# EAGLE design Stepper Board (EAGLE 7.5.0)
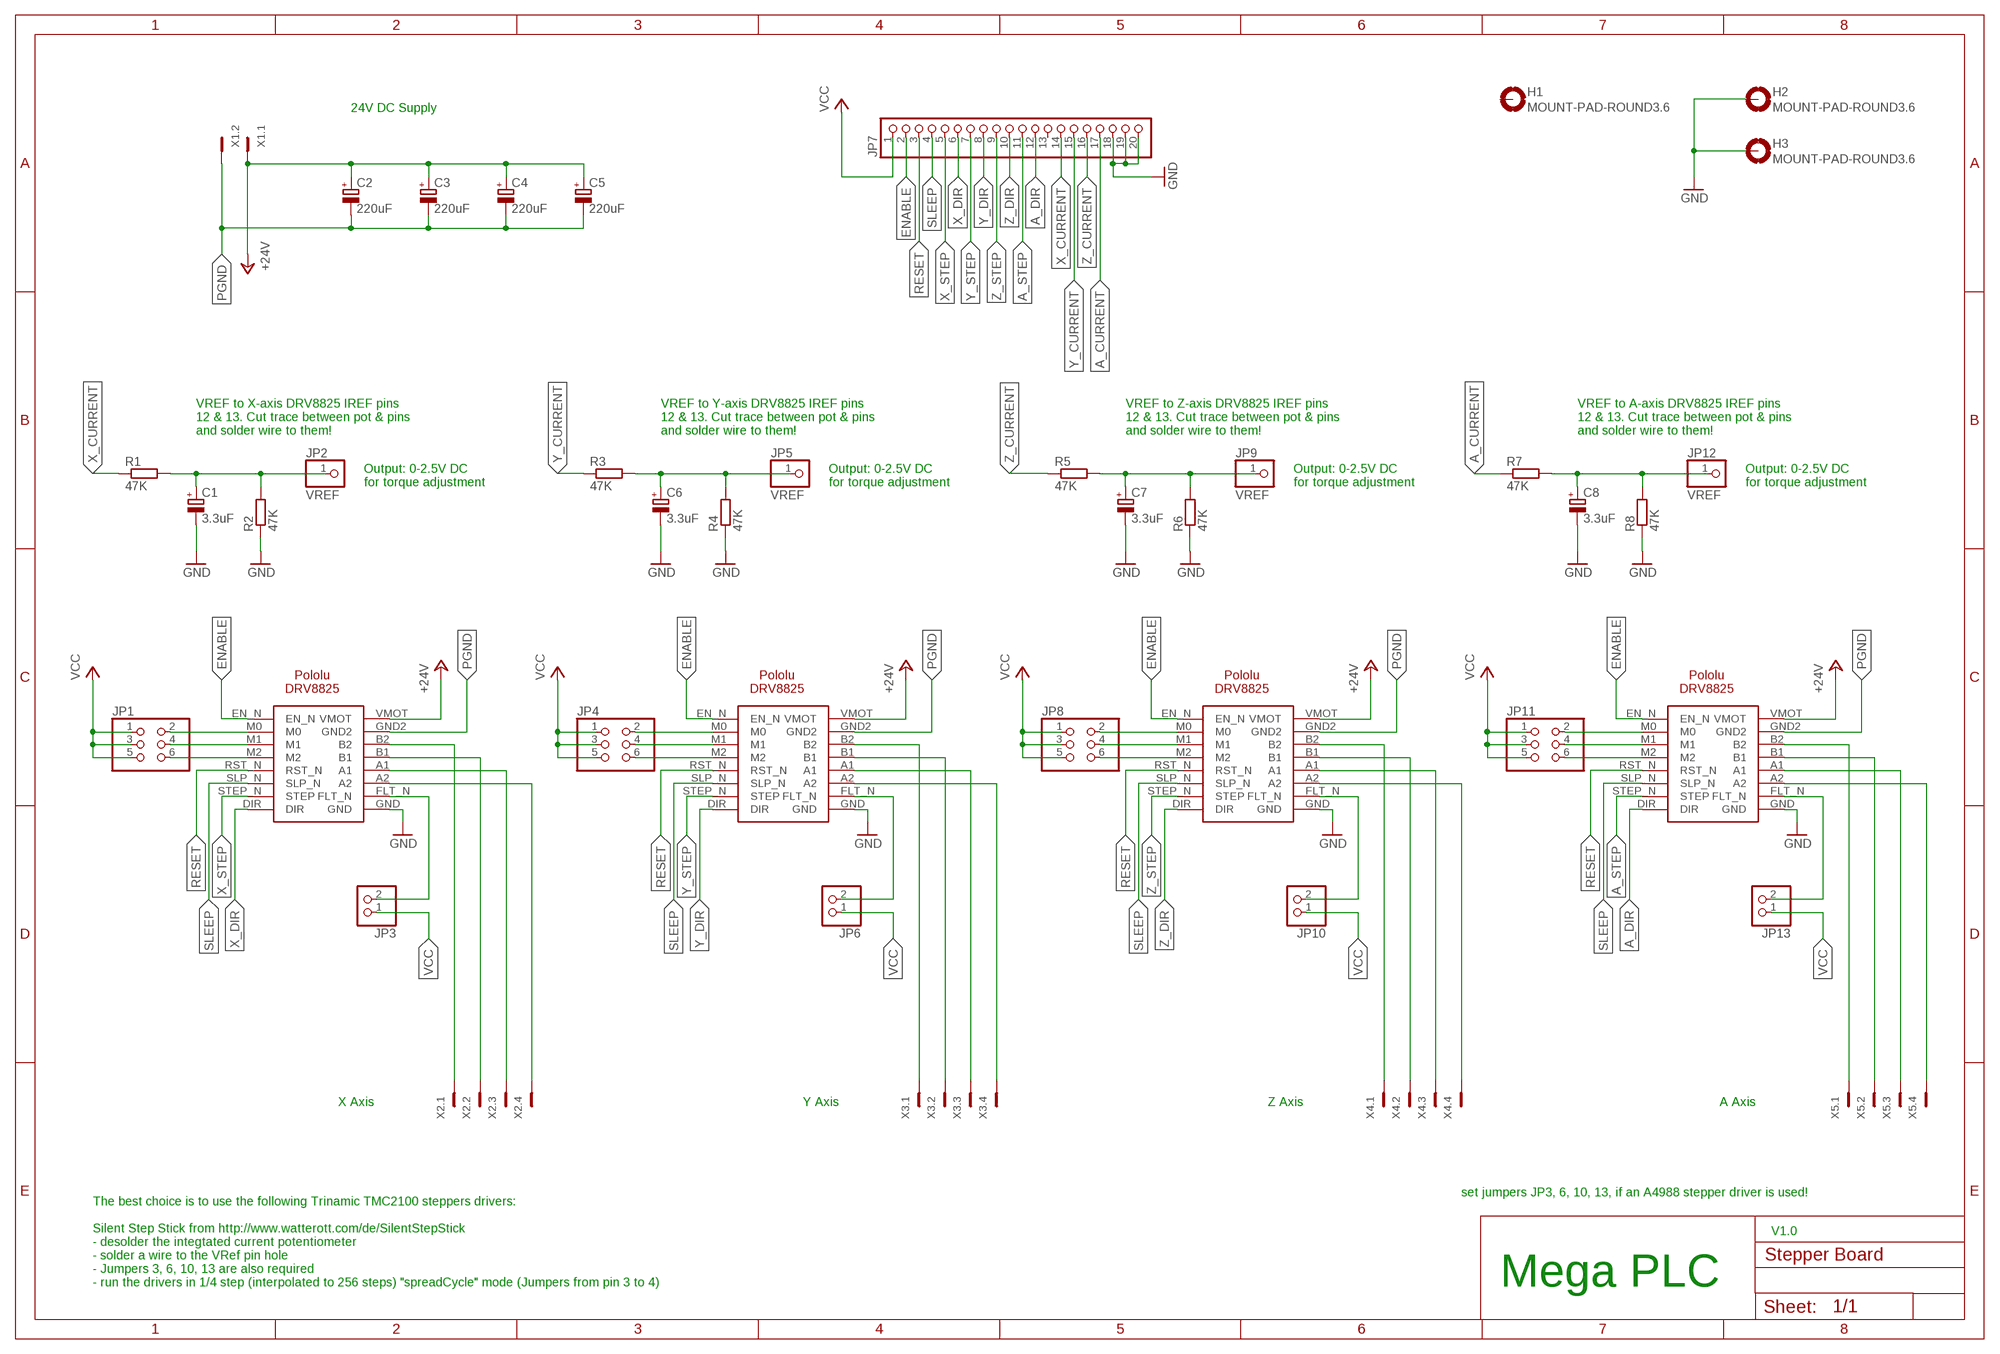
[diagram p0: schematic, sheet 1]

## Parts
C1  3.3uF  CPOL-EUB45181A  [B45181A]
C2  220uF  CPOL-EUE5-10.5  [E5-10,5]
C3  220uF  CPOL-EUE5-10.5  [E5-10,5]
C4  220uF  CPOL-EUE5-10.5  [E5-10,5]
C5  220uF  CPOL-EUE5-10.5  [E5-10,5]
C6  3.3uF  CPOL-EUB45181A  [B45181A]
C7  3.3uF  CPOL-EUB45181A  [B45181A]
C8  3.3uF  CPOL-EUB45181A  [B45181A]
H1  MOUNT-PAD-ROUND3.6  [3,6-PAD]
H2  MOUNT-PAD-ROUND3.6  [3,6-PAD]
H3  MOUNT-PAD-ROUND3.6  [3,6-PAD]
JP1  PINHD-2X3  [2X03]
JP2  VREF  PINHD-1X1  [1X01]
JP3  PINHD-1X2  [1X02]
JP4  PINHD-2X3  [2X03]
JP5  VREF  PINHD-1X1  [1X01]
JP6  PINHD-1X2  [1X02]
JP7  PINHD-1X20/90  [1X20/90]
JP8  PINHD-2X3  [2X03]
JP9  VREF  PINHD-1X1  [1X01]
JP10  PINHD-1X2  [1X02]
JP11  PINHD-2X3  [2X03]
JP12  VREF  PINHD-1X1  [1X01]
JP13  PINHD-1X2  [1X02]
R1  47K  R-EU_0204/7  [0204/7]
R2  47K  R-EU_0207/15  [0207/15]
R3  47K  R-EU_0207/2V  [0207/2V]
R4  47K  R-EU_0207/15  [0207/15]
R5  47K  R-EU_0207/2V  [0207/2V]
R6  47K  R-EU_0207/15  [0207/15]
R7  47K  R-EU_0207/2V  [0207/2V]
R8  47K  R-EU_0207/15  [0207/15]
U1  POLOLU-DRV8825  [POLOLU-DRV8825]
U2  POLOLU-DRV8825  [POLOLU-DRV8825]
U3  POLOLU-DRV8825  [POLOLU-DRV8825]
U4  POLOLU-DRV8825  [POLOLU-DRV8825]
X1  MC2  [MC2]
X2  MC4  [MC4]
X3  MC4  [MC4]
X4  MC4  [MC4]
X5  MC4  [MC4]

## Nets
+24V [24V]: C2.+ C3.+ C4.+ C5.+ U1.VMOT U2.VMOT U3.VMOT U4.VMOT X1.1
A_CURRENT: JP7.17 R7.1
A_DIR: JP7.12 U4.DIR
A_FLT: JP13.2 U4.FLT_N
A_STEP: JP7.11 U4.STEP_N(STEP)
ENABLE: JP7.2 U1.EN_N U2.EN_N U3.EN_N U4.EN_N
GND: C1.- C6.- C7.- C8.- H2.B3,6(MOUNT) H3.B3,6(MOUNT) JP7.18 JP7.19 JP7.20 R2.1 R4.1 R6.1 R8.1 U1.GND U2.GND U3.GND U4.GND
N$1: U1.A2 X2.4
N$2: U1.A1 X2.3
N$3: JP1.2 U1.M0
N$4: JP1.4 U1.M1
N$5: JP1.6 U1.M2
N$6: U1.B1 X2.2
N$7: U1.B2 X2.1
N$8: U2.A2 X3.4
N$9: U2.A1 X3.3
N$10: U2.B1 X3.2
N$11: U2.B2 X3.1
N$12: U3.A2 X4.4
N$13: U3.A1 X4.3
N$14: U3.B1 X4.2
N$15: U3.B2 X4.1
N$16: U4.A2 X5.4
N$17: U4.A1 X5.3
N$18: U4.B1 X5.2
N$19: U4.B2 X5.1
N$20: JP4.2 U2.M0
N$21: JP4.4 U2.M1
N$22: JP4.6 U2.M2
N$23: JP8.2 U3.M0
N$24: JP8.4 U3.M1
N$25: JP8.6 U3.M2
N$26: JP11.2 U4.M0
N$27: JP11.4 U4.M1
N$28: JP11.6 U4.M2
N$29: C8.+ JP12.1 R7.2 R8.2
N$30: C7.+ JP9.1 R5.2 R6.2
N$31: C6.+ JP5.1 R3.2 R4.2
N$32: C1.+ JP2.1 R1.2 R2.2
PGND [24V]: C2.- C3.- C4.- C5.- U1.GND2 U2.GND2 U3.GND2 U4.GND2 X1.2
RESET: JP7.3 U1.RST_N U2.RST_N U3.RST_N U4.RST_N
SLEEP: JP7.4 U1.SLP_N U2.SLP_N U3.SLP_N U4.SLP_N
VCC: JP1.1 JP1.3 JP1.5 JP3.1 JP4.1 JP4.3 JP4.5 JP6.1 JP7.1 JP8.1 JP8.3 JP8.5 JP10.1 JP11.1 JP11.3 JP11.5 JP13.1
X_CURRENT: JP7.14 R1.1
X_DIR: JP7.6 U1.DIR
X_FLT: JP3.2 U1.FLT_N
X_STEP: JP7.5 U1.STEP_N(STEP)
Y_CURRENT: JP7.15 R3.1
Y_DIR: JP7.8 U2.DIR
Y_FLT: JP6.2 U2.FLT_N
Y_STEP: JP7.7 U2.STEP_N(STEP)
Z_CURRENT: JP7.16 R5.1
Z_DIR: JP7.10 U3.DIR
Z_FLT: JP10.2 U3.FLT_N
Z_STEP: JP7.9 U3.STEP_N(STEP)
Unconnected: H1.B3,6(MOUNT) JP7.13

## Notes on the sheet
- 24V DC Supply
- VREF to X-axis DRV8825 IREF pins
  12 & 13. Cut trace between pot & pins
  and solder wire to them!
- VREF to Y-axis DRV8825 IREF pins
  12 & 13. Cut trace between pot & pins
  and solder wire to them!
- VREF to Z-axis DRV8825 IREF pins
  12 & 13. Cut trace between pot & pins
  and solder wire to them!
- VREF to A-axis DRV8825 IREF pins
  12 & 13. Cut trace between pot & pins
  and solder wire to them!
- Output: 0-2.5V DC
  for torque adjustment
- Output: 0-2.5V DC
  for torque adjustment
- Output: 0-2.5V DC
  for torque adjustment
- Output: 0-2.5V DC
  for torque adjustment
- X Axis | Y Axis | Z Axis | A Axis
- set jumpers JP3, 6, 10, 13, if an A4988 stepper driver is used!
- V1.0
- The best choice is to use the following Trinamic TMC2100 steppers drivers:
  
  Silent Step Stick from http://www.watterott.com/de/SilentStepStick
  - desolder the integtated current potentiometer
  - solder a wire to the VRef pin hole
  - Jumpers 3, 6, 10, 13 are also required
  - run the drivers in 1/4 step (interpolated to 256 steps) "spreadCycle" mode (Jumpers from pin 3 to 4)
- Mega PLC

## Library data of the parts
C1 C6-C8 = rcl:CPOL-EU: POLARIZED CAPACITOR, European symbol
C2-C5 = resistor:CPOL-EU: POLARIZED CAPACITOR, European symbol
H1-H3 = holes:MOUNT-PAD-ROUND: MOUNTING PAD, round
JP1 JP4 JP8 JP11 = pinhead:PINHD-2X3: PIN HEADER
JP2 JP5 JP9 JP12 = pinhead:PINHD-1X1: PIN HEADER
JP3 JP6 JP10 JP13 = pinhead:PINHD-1X2: PIN HEADER
JP7 = pinhead:PINHD-1X20: PIN HEADER
R1-R8 = rcl:R-EU_: RESISTOR, European symbol
U1-U4 = alvarop:POLOLU-DRV8825
X1 = con-phoenix-381_l:MC2: Mini-Combicon 3.81mm horizontal 2-polig MC 1,5/2-G-3,81 Artikel-Nr. 1803277
X2-X5 = con-phoenix-381_l:MC4: Mini-Combicon 3.81mm horizontal 4-polig MC 1,5/4-G-3,81 Artikel-Nr. 1803293

## Net classes
0 default: width 0.305 mm, clearance 0.254 mm
1 24V: clearance 0.381 mm

## Board
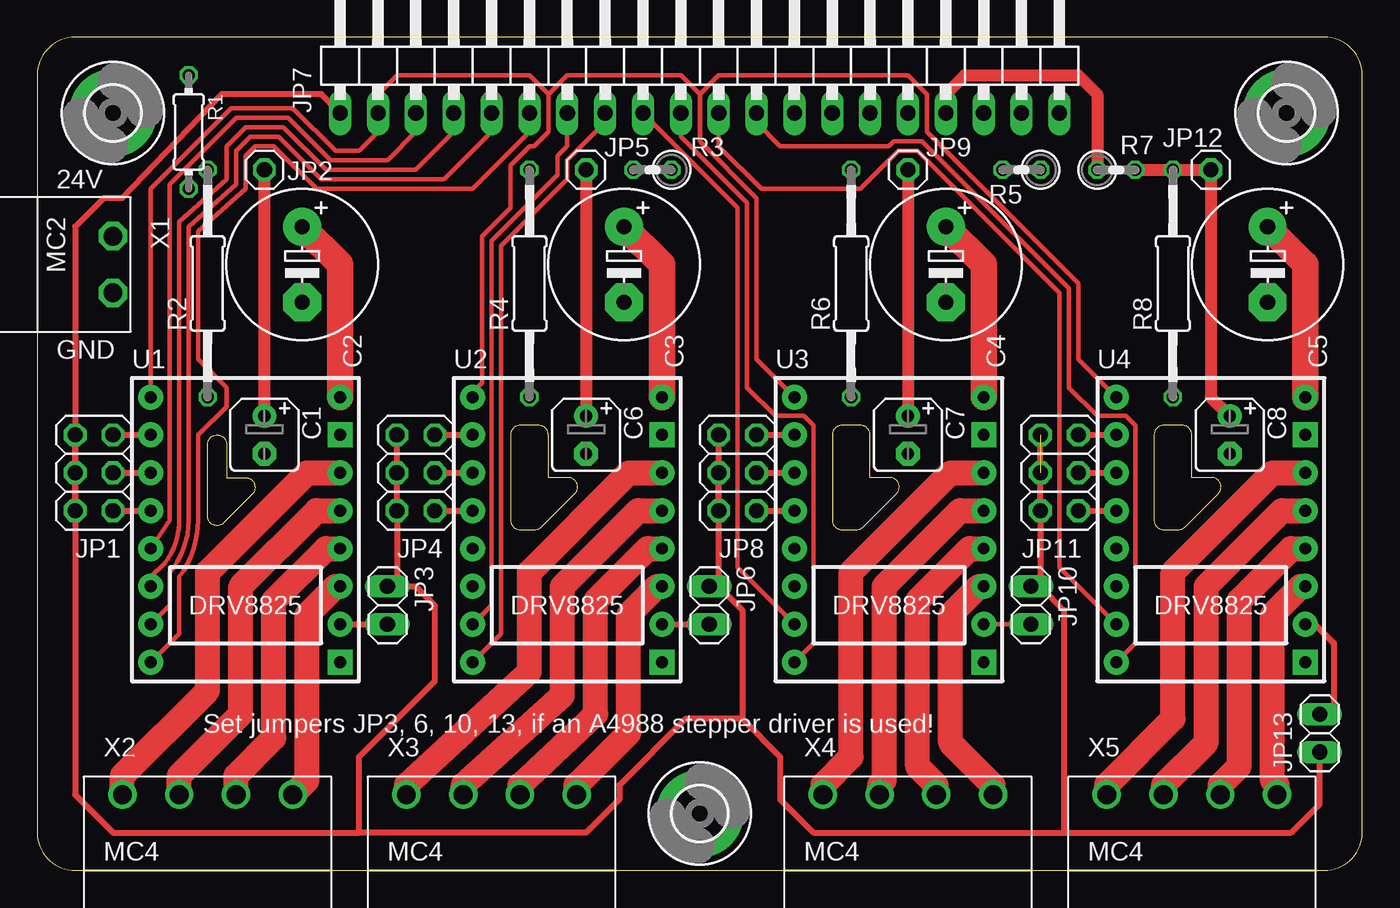
[diagram p1: board, top side]
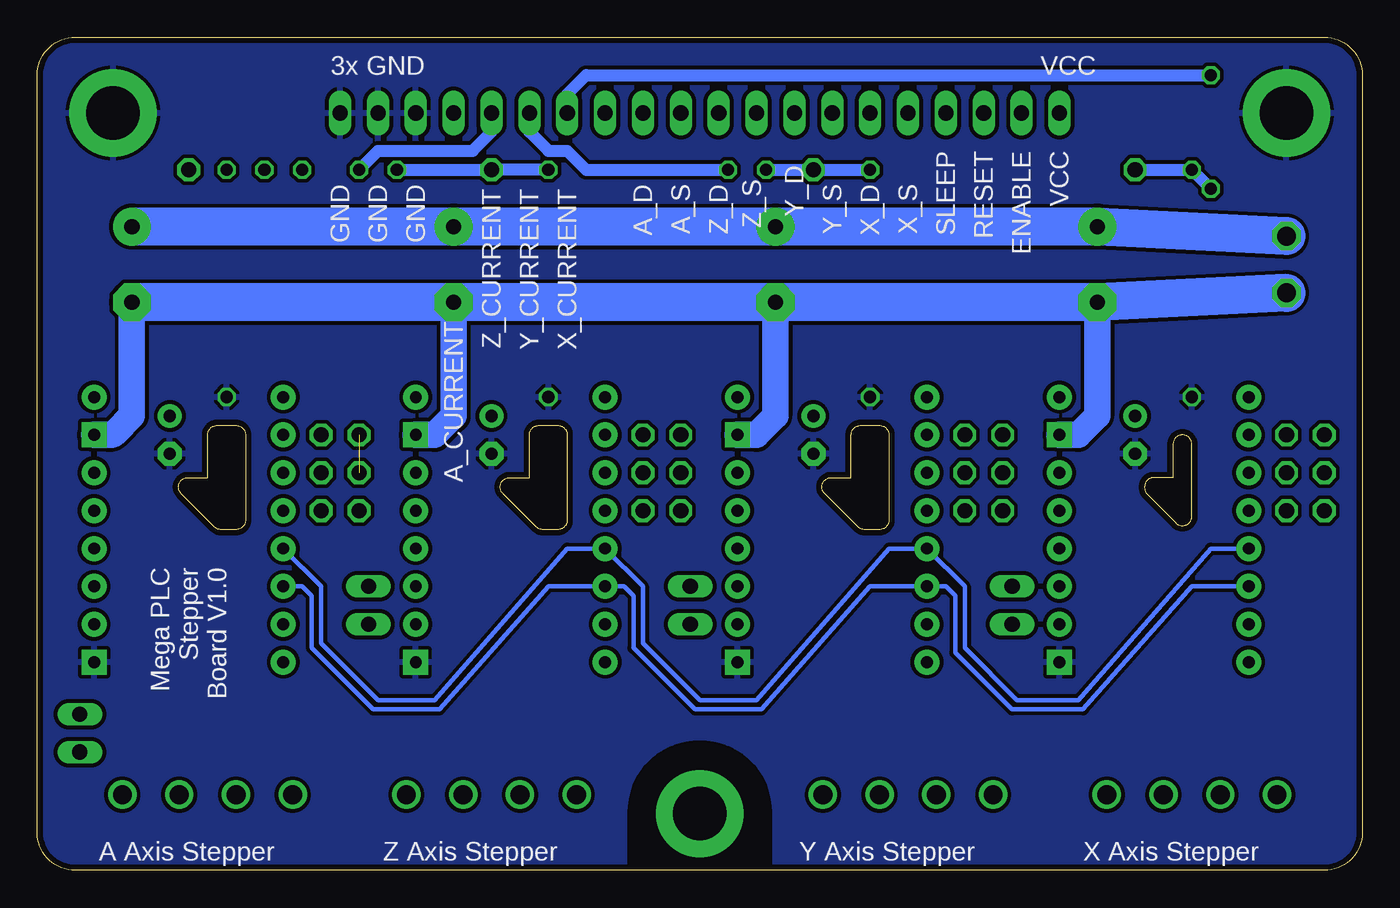
[diagram p2: board, bottom side, seen from below]

Size 88.9 x 55.88 mm. Coordinates in mm from the lower left corner, seen from the top.
Outline: 0,53.34 0,2.54 arc90 2.54,0 86.36,0 arc90 88.9,2.54 88.9,53.34 arc90 86.36,55.88 2.54,55.88 arc90 0,53.34
Outline: 12.06,29.21 arc-90 12.7,28.57 12.7,26.35 13.97,26.35 arc-90 14.61,25.72 14.61,25.66 arc-45 14.42,25.21 12.51,23.31 arc-135 11.43,23.76 11.43,28.57 arc-90 12.06,29.21
Outline: 34.29,26.35 34.29,29.21 arc90 33.66,29.84 32.38,29.84 arc90 31.75,29.21 31.75,23.5 arc90 32.38,22.86 33.39,22.86 arc45 33.84,23.05 36.06,25.27 arc135 35.61,26.35 34.29,26.35
Outline: 55.88,26.35 55.88,29.21 arc90 55.24,29.84 53.98,29.84 arc90 53.34,29.21 53.34,23.5 arc90 53.98,22.86 54.98,22.86 arc45 55.43,23.05 57.65,25.27 arc135 57.2,26.35 55.88,26.35
Outline: 77.47,26.35 77.47,29.21 arc90 76.83,29.84 75.56,29.84 arc90 74.93,29.21 74.93,23.5 arc90 75.56,22.86 76.57,22.86 arc45 77.02,23.05 79.24,25.27 arc135 78.79,26.35 77.47,26.35
Copper layers (1*16): Top 0.0356mm / dielectric 1.5011mm / Bottom 0.0356mm
Design rules "OSHPark_LaenPCBOrder": minimum track width 6mil, minimum drill 13mil, track to track 6mil, track to pad 6mil, pad to pad 6mil, via to via 6mil, smd to smd 6mil, copper to edge 15mil, drill to drill 6mil, minimum pad ring 7mil, minimum via ring 7mil, stop-mask expansion 3mil, vias tented up to drill 0mil, thermal gap 10mil

### Footprints (pad centres in the part's own frame; a part is rotated, then mirrored left to right if it is on the bottom)
B45181A = drill 0.813 pad 1.6: + -1.27,0 | drill 0.813 pad 1.6 octagon: - 1.27,0
E5-10,5 = drill 1.016 pad 2.54: + -2.54,0 | drill 1.016 pad 2.54 octagon: - 2.54,0
3,6-PAD = drill 3.6 pad 5.842: B3,6 0,0
2X03 = drill 1.016 octagon: 1 -2.54,-1.27; 2 -2.54,1.27; 3 0,-1.27; 4 0,1.27; 5 2.54,-1.27; 6 2.54,1.27
1X01 = drill 1.016 octagon: 1 0,0
1X02 = drill 1.016 long: 1 -1.27,0; 2 1.27,0
1X20/90 = drill 1.016 long: 1 -24.13,-3.81; 2 -21.59,-3.81; 3 -19.05,-3.81; 4 -16.51,-3.81; 5 -13.97,-3.81; 6 -11.43,-3.81; 7 -8.89,-3.81; 8 -6.35,-3.81; 9 -3.81,-3.81; 10 -1.27,-3.81; 11 1.27,-3.81; 12 3.81,-3.81; 13 6.35,-3.81; 14 8.89,-3.81; 15 11.43,-3.81; 16 13.97,-3.81; 17 16.51,-3.81; 18 19.05,-3.81; 19 21.59,-3.81; 20 24.13,-3.81
0204/7 = drill 0.813 octagon: 1 -3.81,0; 2 3.81,0
0207/15 = drill 0.813 octagon: 1 -7.62,0; 2 7.62,0
0207/2V = drill 0.813 octagon: 1 -1.27,0; 2 1.27,0
POLOLU-DRV8825 = drill 0.8 pad 1.676: A1 6.35,-1.27; A2 6.35,-3.81; B1 6.35,1.27; B2 6.35,3.81; DIR -6.35,-8.89; EN_N -6.35,8.89; FLT_N 6.35,-6.35; M0 -6.35,6.35; M1 -6.35,3.81; M2 -6.35,1.27; RST_N -6.35,-1.27; SLP_N -6.35,-3.81; STEP_N -6.35,-6.35; VMOT 6.35,8.89 | drill 0.8 pad 1.676 square: GND 6.35,-8.89; GND2 6.35,6.35
MC2 = drill 1.27 octagon: 1 -1.905,0; 2 1.905,0
MC4 = drill 1.27: 1 -5.715,0; 2 -1.905,0; 3 1.905,0; 4 5.715,0

### Placement (x,y rotation side)
C1  15.24,29.21 270 top
C2  17.78,40.64 270 top
C3  39.37,40.64 270 top
C4  60.96,40.64 270 top
C5  82.55,40.64 270 top
C6  36.83,29.21 270 top
C7  58.42,29.21 270 top
C8  80.01,29.21 270 top
H1  44.45,3.81 0 top
H2  83.82,50.8 0 top
H3  5.08,50.8 0 top
JP1  3.81,26.67 270 top
JP2  15.24,46.99 0 top
JP3  23.5,17.78 270 top
JP4  25.4,26.67 270 top
JP5  36.83,46.99 0 top
JP6  45.09,17.78 270 top
JP7  44.45,54.61 0 top
JP8  46.99,26.67 270 top
JP9  58.42,46.99 0 top
JP10  66.67,17.78 270 top
JP11  68.58,26.67 270 top
JP12  78.74,46.99 180 top
JP13  86.04,9.21 90 top
R1  10.16,49.53 270 top
R2  11.43,39.37 90 top
R3  41.27,46.99 180 top
R4  33.02,39.37 90 top
R5  66.04,46.99 180 top
R6  54.61,39.37 90 top
R7  72.39,46.99 0 top
R8  76.2,39.37 90 top
U1  13.97,22.86 0 top
U2  35.56,22.86 0 top
U3  57.15,22.86 0 top
U4  78.74,22.86 0 top
X1  5.08,40.64 270 top
X2  11.43,5.08 0 top
X3  30.48,5.08 0 top
X4  58.42,5.08 0 top
X5  77.47,5.08 0 top

### Tracks (layer width: path | path; a pad name or v marks a point on that pad's centre or on a via)
+24V
  Top 1.778: C2.+ 20.32,40.64 U1.VMOT | C3.+ 41.91,40.64 U2.VMOT | C4.+ 63.5,40.64 U3.VMOT | C5.+ 85.09,40.64 U4.VMOT
  Bottom 2.54: X1.1 C2.+ C3.+ C4.+ C5.+
A_CURRENT
  Top 0.813: R7.1 71.12,52.07 69.85,53.34 62.23,53.34 60.96,52.07 JP7.17
A_DIR
  Top 0.305: JP7.12 48.26,50.16 49.85,48.58 57.15,48.58 57.47,48.9 59.37,48.9 69.22,39.05 69.22,32.38 71.12,30.48 73.03,30.48 73.66,29.84 73.66,15.24 U4.DIR
A_FLT
  Top 0.406: U4.FLT_N 85.72,16.51 87,15.24 87,10.79 86.36,10.16 JP13.2
A_STEP
  Top 0.305: JP7.11 45.72,48.58 48.58,45.72 55.24,45.72 57.78,48.26 59.05,48.26 68.58,38.73 68.58,20.32 U4.STEP_N
ENABLE
  Top 0.305: U1.EN_N 7.62,45.72 13.02,51.12 17.14,51.12 20,48.26 21.59,48.26 22.86,49.53 JP7.2 22.86,52.07 24.13,53.34 33.02,53.34 34.29,52.07 | U2.EN_N 29.21,32.07 29.84,32.7 29.84,42.55 31.75,44.45 31.75,47.31 33.02,48.58 33.34,48.58 34.29,49.53 34.29,52.07 | 34.29,52.07 35.56,53.34 43.18,53.34 44.45,52.07 | 44.45,52.07 44.45,48.9 48.26,45.09 48.26,34.29 U3.EN_N | U4.EN_N 69.85,34.29 69.85,39.37 59.69,49.53 59.69,52.07 58.42,53.34 45.72,53.34 44.45,52.07
GND
  pour Bottom: -1.27,57.15 -1.27,-1.27 39.37,-1.27 39.37,3.89 arc-90 44.37,8.89 44.53,8.89 arc-90 49.53,3.89 49.53,-1.27 90.17,-1.27 90.17,57.15
N$1
  Top 1.676: X2.4 18.1,6.03 18.1,17.14 20,19.05 U1.A2
N$2
  Top 1.676: X2.3 13.34,6.35 15.88,8.89 15.88,18.1 19.37,21.59 U1.A1
N$3
  Top 0.406: JP1.2 U1.M0
N$4
  Top 0.406: JP1.4 U1.M1
N$5
  Top 0.406: JP1.6 U1.M2
N$6
  Top 1.676: X2.2 9.53,6.35 13.65,10.48 13.65,19.05 18.73,24.13 U1.B1
N$7
  Top 1.676: X2.1 5.71,6.35 11.43,12.06 11.43,20 18.1,26.67 U1.B2
N$8
  Top 1.676: 36.2,5.71 39.69,9.21 39.69,17.14 41.59,19.05 U2.A2
  Top 1.778: X3.4 36.2,5.71
N$9
  Top 1.676: X3.3 32.38,5.71 37.47,10.48 37.47,18.1 40.96,21.59 U2.A1
N$10
  Top 1.676: X3.2 28.57,5.71 35.24,11.75 35.24,19.05 40.32,24.13 U2.B1
N$11
  Top 1.676: X3.1 24.77,5.71 33.02,13.34 33.02,20 39.69,26.67 U2.B2
N$12
  Top 1.676: X4.4 64.14,5.71 61.28,8.57 61.28,17.14 63.18,19.05 U3.A2
N$13
  Top 1.676: X4.3 60.33,5.71 59.05,6.99 59.05,18.1 62.55,21.59 U3.A1
N$14
  Top 1.676: X4.2 56.52,5.71 56.83,6.03 56.83,19.05 61.91,24.13 U3.B1
N$15
  Top 1.676: X4.1 52.7,5.71 54.61,7.62 54.61,20 61.28,26.67 U3.B2
N$16
  Top 1.676: X5.4 83.19,5.71 82.87,6.03 82.87,17.14 84.77,19.05 U4.A2
N$17
  Top 1.676: X5.3 79.38,5.71 80.64,6.99 80.64,18.1 84.14,21.59 U4.A1
N$18
  Top 1.676: X5.2 75.56,5.71 78.42,8.57 78.42,19.05 83.5,24.13 U4.B1
N$19
  Top 1.676: X5.1 71.75,5.71 76.2,10.16 76.2,20 82.87,26.67 U4.B2
N$20
  Top 0.406: JP4.2 U2.M0
N$21
  Top 0.406: JP4.4 U2.M1
N$22
  Top 0.406: JP4.6 U2.M2
N$23
  Top 0.406: JP8.2 U3.M0
N$24
  Top 0.406: JP8.4 U3.M1
N$25
  Top 0.406: JP8.6 U3.M2
N$26
  Top 0.406: JP11.2 U4.M0
N$27
  Top 0.406: JP11.4 U4.M1
N$28
  Top 0.406: JP11.6 U4.M2
N$29
  Top 0.813: R7.2 R8.2 JP12.1 78.74,31.75 C8.+
N$30
  Top 0.813: JP9.1 C7.+
  Bottom 0.813: R6.2 JP9.1 R5.2
N$31
  Top 0.813: JP5.1 C6.+
  Bottom 0.813: R3.2 JP5.1 R4.2
N$32
  Top 0.813: JP2.1 C1.+
  Bottom 0.813: JP2.1 R2.2 R1.2
PGND
  Bottom 1.778: C2.- 17.78,30.48 19.05,29.21 U1.GND2 | C3.- 39.37,30.48 40.64,29.21 U2.GND2 | C4.- 60.96,30.48 62.23,29.21 U3.GND2 | C5.- 82.55,30.48 83.63,29.4 arc45 84.08,29.21 U4.GND2
  Bottom 2.54: X1.2 C2.- C3.- C4.- C5.-
RESET
  Top 0.305: 25.4,49.53 23.5,47.62 19.68,47.62 16.83,50.48 13.34,50.48 8.89,46.04 8.89,23.5 U1.RST_N
  Top 0.406: JP7.3 25.4,49.53
  Bottom 0.305: U1.RST_N 10.16,21.59 19.05,11.43 23.18,11.43 26.67,14.92 26.67,19.05 U2.RST_N 31.75,21.59 40.64,11.43 44.45,11.43 48.26,15.24 48.26,19.05 U3.RST_N 53.34,21.59 62.23,11.43 66.04,11.43 69.85,15.24 69.85,19.05 U4.RST_N
SLEEP
  Top 0.305: 27.94,49.53 25.4,46.99 19.37,46.99 16.51,49.85 13.97,49.85 12.7,48.58 12.7,46.35 9.53,43.5 9.53,23.5 arc-37 8.57,20.64 7.62,19.68 U1.SLP_N
  Top 0.406: JP7.4 27.94,49.53
  Bottom 0.305: U1.SLP_N 11.43,19.05 18.73,10.79 23.5,10.79 27.3,14.61 27.3,18.41 27.94,19.05 U2.SLP_N 33.02,19.05 40.32,10.79 44.77,10.79 48.9,14.92 48.9,18.41 49.53,19.05 U3.SLP_N 54.61,19.05 61.91,10.79 66.36,10.79 70.48,14.92 70.48,18.41 71.12,19.05 U4.SLP_N
VCC  (1 unrouted)
  Top 0.406: JP1.5 JP1.3 JP1.1 | JP4.1 JP4.3 JP4.5 24.13,19.05 | JP8.5 JP8.3 | JP11.1 JP11.5 67.31,19.05 | JP1.1 2.54,5.08 5.08,2.54 21.59,2.54 | 21.59,2.54 21.59,7.62 26.67,12.7 26.67,17.78 25.4,19.05 24.13,19.05 | JP8.1 JP8.3 | 21.59,2.54 36.83,2.54 39.05,4.76 39.05,5.71 43.5,10.16 47.31,10.16 | JP7.1 19.05,52.07 12.38,52.07 5.71,45.09 4.45,45.09 2.54,43.18 JP1.1 | 24.13,19.05 JP3.1 | JP8.3 45.72,19.05 | 45.72,19.05 JP6.1 | 45.72,19.05 47.31,17.46 47.31,10.16 | 47.31,10.16 49.85,7.62 49.85,4.76 52.07,2.54 68.9,2.54 | 68.9,2.54 84.14,2.54 86.04,4.45 JP13.1 | JP10.1 67.31,19.05 | 67.31,19.05 68.9,17.46 68.9,2.54
X_CURRENT
  Bottom 0.813: JP7.14 53.34,52.07 52.07,53.34 R1.1
X_DIR
  Top 0.305: 33.02,49.53 29.21,45.72 18.73,45.72 15.88,48.58 14.61,48.58 13.97,47.94 13.97,45.72 10.79,42.86 10.79,34.29 12.7,32.38 12.7,31.11 10.79,29.21 10.79,23.5 arc-37 9.53,19.68 9.53,15.88 U1.DIR
  Top 0.406: JP7.6 33.02,49.53
X_FLT
  Top 0.406: U1.FLT_N JP3.2
X_STEP
  Top 0.305: 30.48,49.53 27.3,46.35 19.05,46.35 16.19,49.21 14.29,49.21 13.34,48.26 13.34,46.04 10.16,43.18 10.16,23.5 arc-40 8.89,20 8.89,17.78 U1.STEP_N
  Top 0.406: JP7.5 30.48,49.53
Y_CURRENT
  Bottom 0.813: JP7.15 55.88,49.53 54.61,48.26 53.34,48.26 52.07,46.99 R3.1
Y_DIR
  Top 0.305: JP7.8 38.1,50.16 35.56,47.62 35.56,46.35 31.11,41.91 31.11,15.88 U2.DIR
Y_FLT
  Top 0.406: U2.FLT_N JP6.2
Y_STEP
  Top 0.305: JP7.7 35.56,48.58 34.92,47.94 34.92,46.67 30.48,42.23 30.48,17.78 U2.STEP_N
Z_CURRENT
  Bottom 0.813: R5.1 66.04,48.26 59.69,48.26 58.42,49.53 JP7.16
Z_DIR
  Top 0.305: JP7.10 43.18,49.21 47.62,44.77 47.62,32.38 49.53,30.48 51.44,30.48 52.07,29.84 52.07,15.24 U3.DIR
Z_FLT
  Top 0.305: U3.FLT_N JP10.2
Z_STEP
  Top 0.305: JP7.9 46.99,44.45 46.99,20.32 U3.STEP_N

### Text on the board
tNames: 24V | GND | Set jumpers JP3, 6, 10, 13, if an A4988 stepper driver is used!
bNames: VCC | 3x GND | VCC | ENABLE | RESET | SLEEP | Y_D | X_S | X_D | Y_S | Z_S | Z_D | A_S | A_D | X_CURRENT | Y_CURRENT | Z_CURRENT | GND | GND | GND | A_CURRENT | Mega PLC / Stepper / Board V1.0 | X Axis Stepper | Y Axis Stepper | Z Axis Stepper | A Axis Stepper